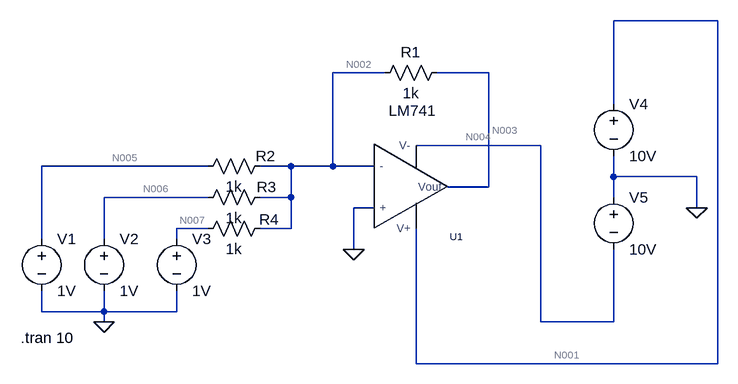
[diagram p0: schematic scallin adder.asc]
scallin adder.asc, the LTspice schematic file:
Version 4.1
SHEET 1 880 680
WIRE 736 -96 576 -96
WIRE 224 -16 144 -16
WIRE 384 -16 304 -16
WIRE 576 32 576 -96
WIRE 464 96 272 96
WIRE -48 128 -304 128
WIRE 80 128 32 128
WIRE 144 128 144 -16
WIRE 144 128 80 128
WIRE 208 128 144 128
WIRE 576 144 576 112
WIRE 704 144 576 144
WIRE 384 160 384 -16
WIRE 384 160 320 160
WIRE -48 176 -208 176
WIRE 80 176 80 128
WIRE 80 176 32 176
WIRE 576 176 576 144
WIRE 208 192 176 192
WIRE 704 192 704 144
WIRE -48 224 -96 224
WIRE 80 224 80 176
WIRE 80 224 32 224
WIRE -304 240 -304 128
WIRE -208 240 -208 176
WIRE -96 240 -96 224
WIRE 176 256 176 192
WIRE -304 352 -304 320
WIRE -208 352 -208 320
WIRE -208 352 -304 352
WIRE -96 352 -96 320
WIRE -96 352 -208 352
WIRE -208 368 -208 352
WIRE 464 368 464 96
WIRE 576 368 576 256
WIRE 576 368 464 368
WIRE 272 432 272 224
WIRE 736 432 736 -96
WIRE 736 432 272 432
FLAG 176 256 0
FLAG 704 192 0
FLAG -208 368 0
SYMBOL LM\ 741\\LM741 256 144 M180
SYMATTR InstName U1
SYMBOL res 320 -32 R90
WINDOW 0 0 56 VBottom 2
WINDOW 3 32 56 VTop 2
SYMATTR InstName R1
SYMATTR Value 1k
SYMBOL res 48 112 R90
WINDOW 0 16 7 VBottom 2
WINDOW 3 32 56 VTop 2
SYMATTR InstName R2
SYMATTR Value 1k
SYMBOL res 48 160 R90
WINDOW 0 16 6 VBottom 2
WINDOW 3 32 56 VTop 2
SYMATTR InstName R3
SYMATTR Value 1k
SYMBOL res 48 208 R90
WINDOW 0 18 2 VBottom 2
WINDOW 3 32 56 VTop 2
SYMATTR InstName R4
SYMATTR Value 1k
SYMBOL voltage -304 224 R0
WINDOW 123 0 0 Left 0
WINDOW 39 0 0 Left 0
SYMATTR InstName V1
SYMATTR Value 1V
SYMBOL voltage -208 224 R0
WINDOW 123 0 0 Left 0
WINDOW 39 0 0 Left 0
SYMATTR InstName V2
SYMATTR Value 1V
SYMBOL voltage -96 224 R0
WINDOW 123 0 0 Left 0
WINDOW 39 0 0 Left 0
SYMATTR InstName V3
SYMATTR Value 1V
SYMBOL voltage 576 16 R0
WINDOW 123 0 0 Left 0
WINDOW 39 0 0 Left 0
SYMATTR InstName V4
SYMATTR Value 10V
SYMBOL voltage 576 160 R0
WINDOW 123 0 0 Left 0
WINDOW 39 0 0 Left 0
SYMATTR InstName V5
SYMATTR Value 10V
TEXT -336 392 Left 2 !.tran 10

The netlist it stands for:
* scallin adder.asc
X§U1 0 N002 N001 N004 N003 LM741  ; pins + - V+ V- Vout
R1 N003 N002 1k
R2 N002 N005 1k
R3 N002 N006 1k
R4 N002 N007 1k
V1 N005 0 1V
V2 N006 0 1V
V3 N007 0 1V
V4 N001 0 10V
V5 0 N004 10V
.tran 10
.lib C:\Users\Subodha\Desktop\Desk\2nd Semester\Electronics\LT Spices\Unity gain amplifier\LM 741\lm741.lib
.backanno
.end

* Results of the author's LTspice run, read from the files saved beside the schematic
* Operating Point, zero values left out:
*   V(n001) = 10 V
*   V(n003) = -2.996 V
*   V(n005) = 1 V
*   V(n007) = 1 V
*   V(n002) = 1.016 mV
*   V(n004) = -10 V
*   V(n006) = 1 V
*   I(R4) = -999 µA
*   I(V5) = -4.497 mA
*   I(R1) = -2.997 mA
*   I(V2) = -999 µA
*   I(V3) = -999 µA
*   I(R2) = -999 µA
*   I(R3) = -999 µA
*   I(V1) = -999 µA
*   I(V4) = -1.5 mA
*   Ix(u1:1) = 57.81 nA
*   Ix(u1:2) = 101.9 nA
*   Ix(u1:99) = 1.5 mA
*   Ix(u1:50) = -4.497 mA
*   Ix(u1:28) = 2.997 mA